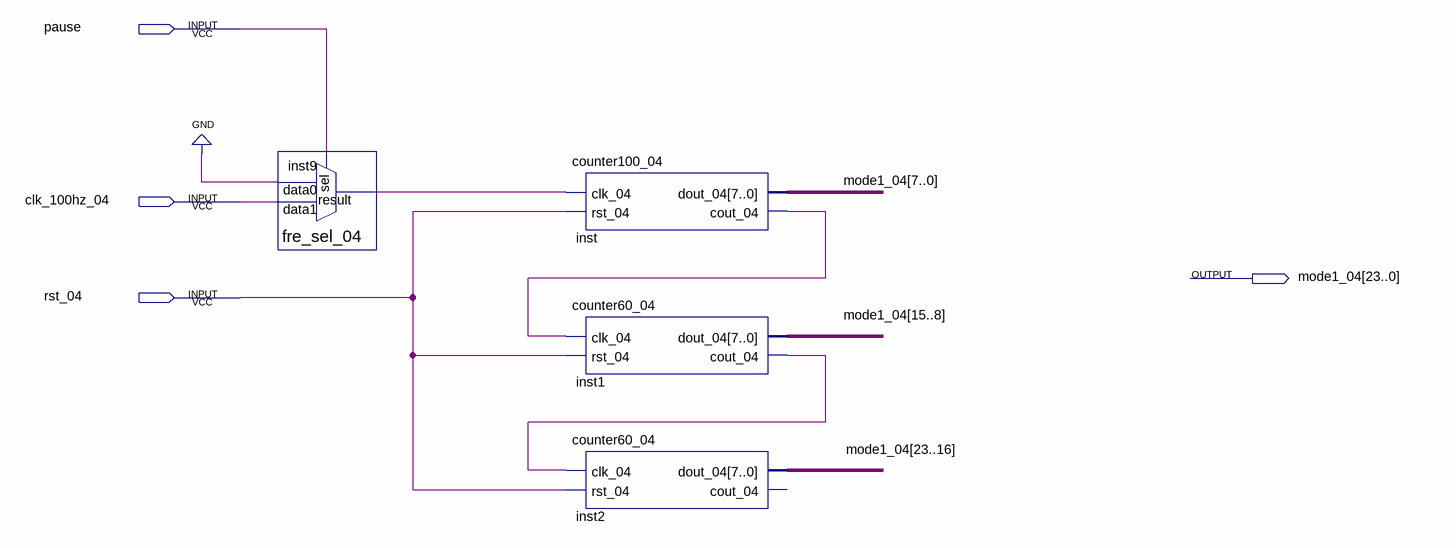
[diagram p0: schematic sheet]
// Quartus schematic timer_04.bdf as structural Verilog: 4 symbols, 4 pins
module timer_04 (
  input  pause,
  input  clk_100hz_04,
  input  rst_04,
  output [23:0] mode1_04
);

  wire inst1_cout_04, inst9_result, inst_cout_04;

  fre_sel_04 inst9 (.data1(clk_100hz_04), .data0(1'b0), .sel(pause), .result(inst9_result));
  counter100_04 inst (.clk_04(inst9_result), .rst_04(rst_04), .dout_04(mode1_04[7:0]), .cout_04(inst_cout_04));
  counter60_04 inst1 (.clk_04(inst_cout_04), .rst_04(rst_04), .dout_04(mode1_04[15:8]), .cout_04(inst1_cout_04));
  counter60_04 inst2 (.clk_04(inst1_cout_04), .rst_04(rst_04), .dout_04(mode1_04[23:16]));  // open: cout_04
endmodule
